# Altium schematic sheet ADS8866.SchDoc
size A4
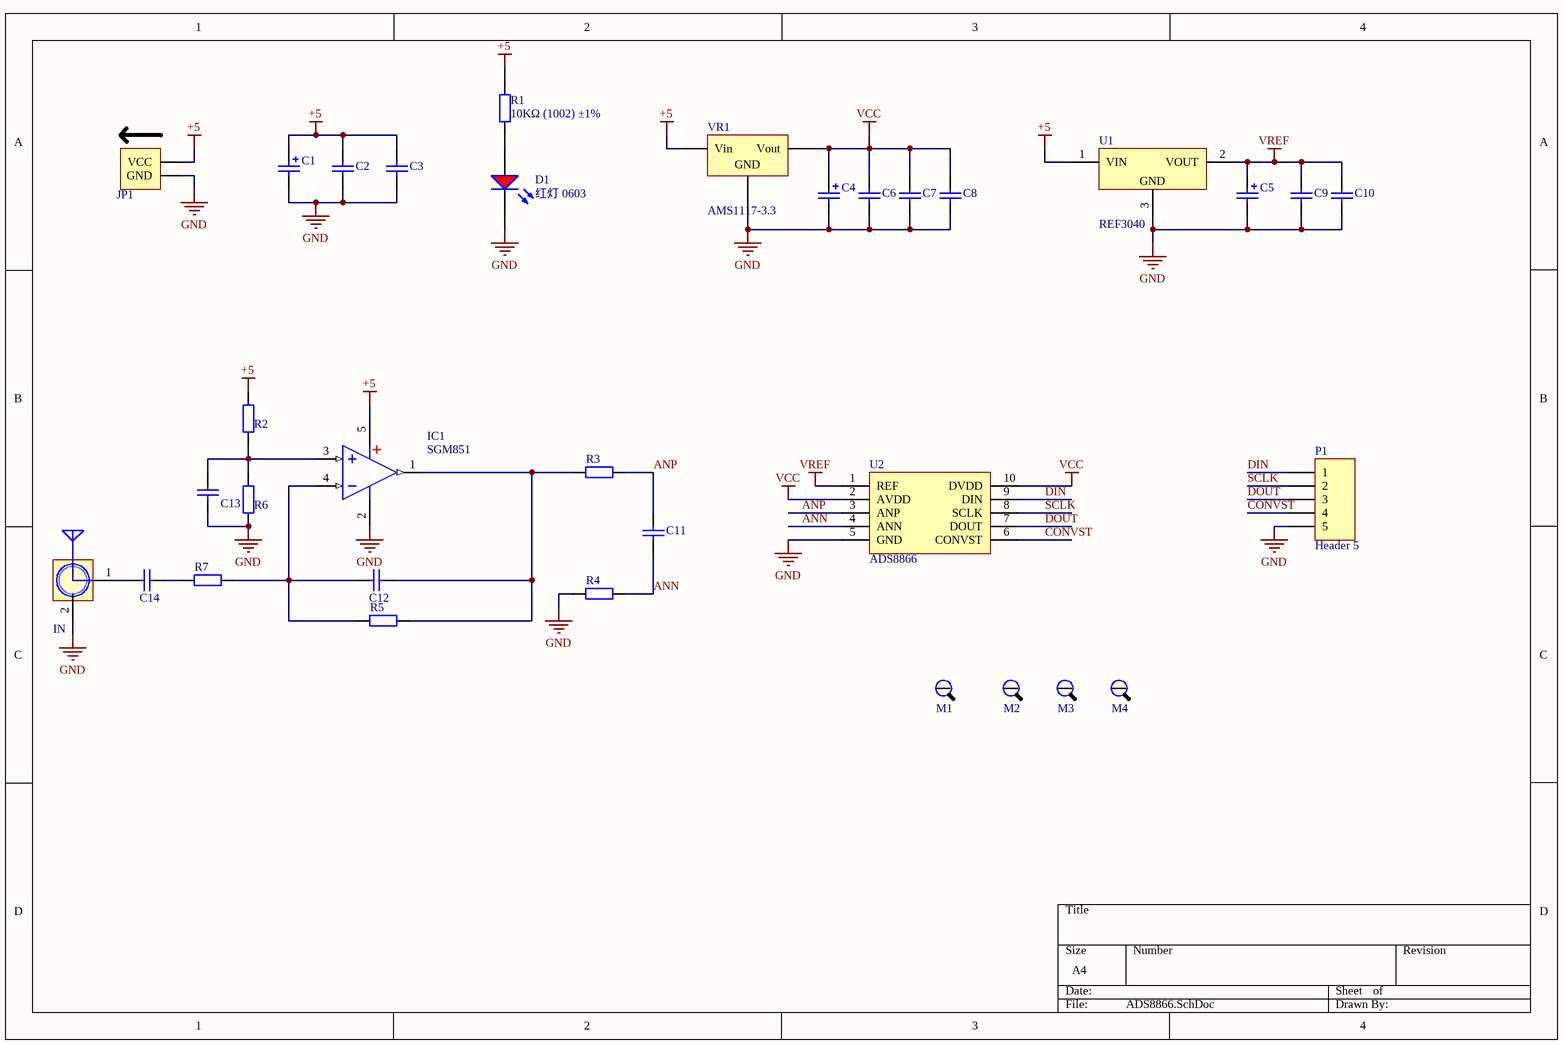
[diagram p0: ADS8866.SchDoc]

## Parts
C1  10uF (106) ±10% 16V  [CASE-A_3216]  (value not drawn)
C2  100nF (104) 10% 50V  [0603_C]  (value not drawn)
C3  100nF (104) 10% 50V  [0603_C]  (value not drawn)
C4  10uF (106) ±10% 16V  [CASE-A_3216]  (value not drawn)
C5  10uF (106) ±10% 16V  [CASE-A_3216]  (value not drawn)
C6  100nF (104) 10% 50V  [0603_C]  (value not drawn)
C7  100nF (104) 10% 50V  [0603_C]  (value not drawn)
C8  100nF (104) 10% 50V  [0603_C]  (value not drawn)
C9  100nF (104) 10% 50V  [0603_C]  (value not drawn)
C10  100nF (104) 10% 50V  [0603_C]  (value not drawn)
C11  1.5nF (152) 10% 50V  [0603_C]  (value not drawn)
C12  100nF (104) 10% 50V  [0603_C]  (value not drawn)
C13  100nF (104) 10% 50V  [0603_C]  (value not drawn)
C14  100nF (104) 10% 50V  [0603_C]  (value not drawn)
D1  红灯 0603  [0603_LED_S1]
IC1  SGM851  [SOT23-5N]
IN  SMA WIFI 天线接口  [SMA]  (value not drawn)
JP1  HDR-1X2  [Power_IN_3.81-2P]  (value not drawn)
M1  M3  [M3x10_L]  (value not drawn)
M2  M3  [M3x10_L]  (value not drawn)
M3  M3  [M3x10_L]  (value not drawn)
M4  M3  [M3x10_L]  (value not drawn)
P1  Header 5  [HDR1X5]
R1  10KΩ (1002) ±1%  [0603_R]
R2  110Ω (1100) ±1%  [0603_R]  (value not drawn)
R3  110Ω (1100) ±1%  [0603_R]  (value not drawn)
R4  110Ω (1100) ±1%  [0603_R]  (value not drawn)
R5  110Ω (1100) ±1%  [0603_R]  (value not drawn)
R6  110Ω (1100) ±1%  [0603_R]  (value not drawn)
R7  110Ω (1100) ±1%  [0603_R]  (value not drawn)
U1  REF3040  [SOT23-3N]
U2  ADS8866  [MSOP10_N]
VR1  AMS1117-3.3  [SOT-223]

## Nets
+5: C1.1 C2.2 C3.2 IC1.5(V+) JP1.1(VCC) R1.2 R2.2 U1.1(VIN) VR1.3(Vin)
GND: C1.2 C2.1 C3.1 C4.2 C5.2 C6.1 C7.1 C8.1 C9.1 C10.1 C13.2 D1.K IC1.2(V-) IN.2 JP1.2(GND) P1.5 R4.1 R6.1 U1.3(GND) U2.5(GND) VR1.1(GND)
VCC: C4.1 C6.2 C7.2 C8.2 U2.2(AVDD) U2.10(DVDD) VR1.2(Vout)
VREF: C5.1 C9.2 C10.2 U1.2(VOUT) U2.1(REF)
ANN: C11.1 R4.2 U2.4(ANN)
ANP: C11.2 R3.2 U2.3(ANP)
CONVST: P1.4 U2.6(CONVST)
DIN: P1.1 U2.9(DIN)
DOUT: P1.3 U2.7(DOUT)
SCLK: P1.2 U2.8(SCLK)
NetC12_1: C12.1 IC1.1(OUT) R3.1 R5.2
NetC12_2: C12.2 IC1.4(IN-) R5.1 R7.2
NetC13_1: C13.1 IC1.3(IN+) R2.1 R6.2
NetC14_1: C14.1 IN.1(SINGLE)
NetC14_2: C14.2 R7.1
NetD1_A: D1.A R1.1

Not connected (* = marked no-connect by the designer): M1 1; M2 1; M3 1; M4 1

## Library data of the parts
C1 C4 C5 = 3216 10uF (106) 10% 16V: 钽电容; ComponentLink1Description: 供应商链接; ComponentLink1URL: http://www.szlcsc.com/product/details_7643.html; Package: 3216; Supplier: LC; SuppliersPartNumber: C7171
C2 C3 C6-C10 C12-C14 = 0603 100nF (104) 10% 50V: 贴片电容; ComponentLink1Description: 供应商链接; ComponentLink1URL: http://www.szlcsc.com/product/details_15331.html; Package: 0603; Supplier: LC; SuppliersPartNumber: C14663
C11 = 0603 1.5nF (152) 10% 50V: 贴片电容; ComponentLink1Description: 供应商链接; ComponentLink1URL: http://www.szlcsc.com/product/details_1947.html; Package: 0603; Supplier: LC; SuppliersPartNumber: C1595
D1 = 0603 红灯: 发光二极管; ComponentLink1Description: 供应商链接; ComponentLink1URL: http://www.szlcsc.com/product/details_2659.html; Package: 0603; Supplier: LC; SuppliersPartNumber: C2286
IC1 = SGM8521-5Pin: SOT23-5_轨至轨运放; BOM名称: 轨至轨运放; 版权归属: 源创客; 学习资源: www.ooocke.com
IN = PORT_SMA: SMA-2.4G射频天线接口; 版权归属: 源创客; BOM名称: SMA-2.4G射频天线接口; 学习资源: www.ooocke.com
JP1 = PORT_Power_IN2: 2P接插件,模块单电源供电口; 版权归属: 源创客; BOM名称: 2P接插件; 学习资源: www.ooocke.com
M1-M4 = ELSE_M3_screw: 螺丝
P1 = Header 5: Header, 5-Pin; LatestRevisionDate: 17-Jul-2002; LatestRevisionNote: Re-released for DXP Platform.; Publisher: Altium Limited
R1 = 0603 10KΩ (1002) 1%: 贴片电阻; ComponentLink1Description: 供应商链接; ComponentLink1URL: http://www.szlcsc.com/product/details_26547.html; Package: 0603; Supplier: LC; SuppliersPartNumber: C25804
R2-R7 = 0603 110Ω (1100) 1%: 贴片电阻; ComponentLink1Description: 供应商链接; ComponentLink1URL: http://www.szlcsc.com/product/details_23508.html; Package: 0603; Supplier: LC; SuppliersPartNumber: C22781
VR1 = SOT-223 AMS1117-3.3: 低压差线性稳压(LDO); ComponentLink1Description: 供应商链接; ComponentLink1URL: http://www.szlcsc.com/product/details_6652.html; Package: SOT-223; Supplier: LC; SuppliersPartNumber: C6186